# Altium schematic sheet VTI_CO2_v2.0.SchDoc: {Наимен. в 1 строку}
size 420 x 297 mm; ApprovedBy: {Утвердил}; CheckedBy: {Проверил}; DrawnBy: {Разработал}; Engineer: {Доп. поле}; Title1str: {Наимен. 1 из 2 строк}; PageSetup: Record=PageOptions|CenterHorizontal=False|CenterVertical=False|PrintScale=0.95|XCorrection=0.00|YCorrection=0.00|PrintKind=2|BorderSize=5000000|LeftOffset=0|BottomOffset=0|Orientation=2|PaperLength=1000|PaperWidth=1000|Scale=100|PaperSource=15|PrintQuality=600|MediaType=1|DitherType=10|PrintScaleMode=1|PaperKind=A4|PaperIndex=9; Title2str: {Наимен. 2 из 2 строк}; ProcessInspection: {Т.контр.}; NormInspection: {Н.контр.}; EngineerName: {Инженер}; DocumentType2str: Схема электрическая принципиальная; ChangeSheet: {1}; NoticeNumber: ИИ, АЦДР.хххх; Rule: PcbType=ProtelPcb
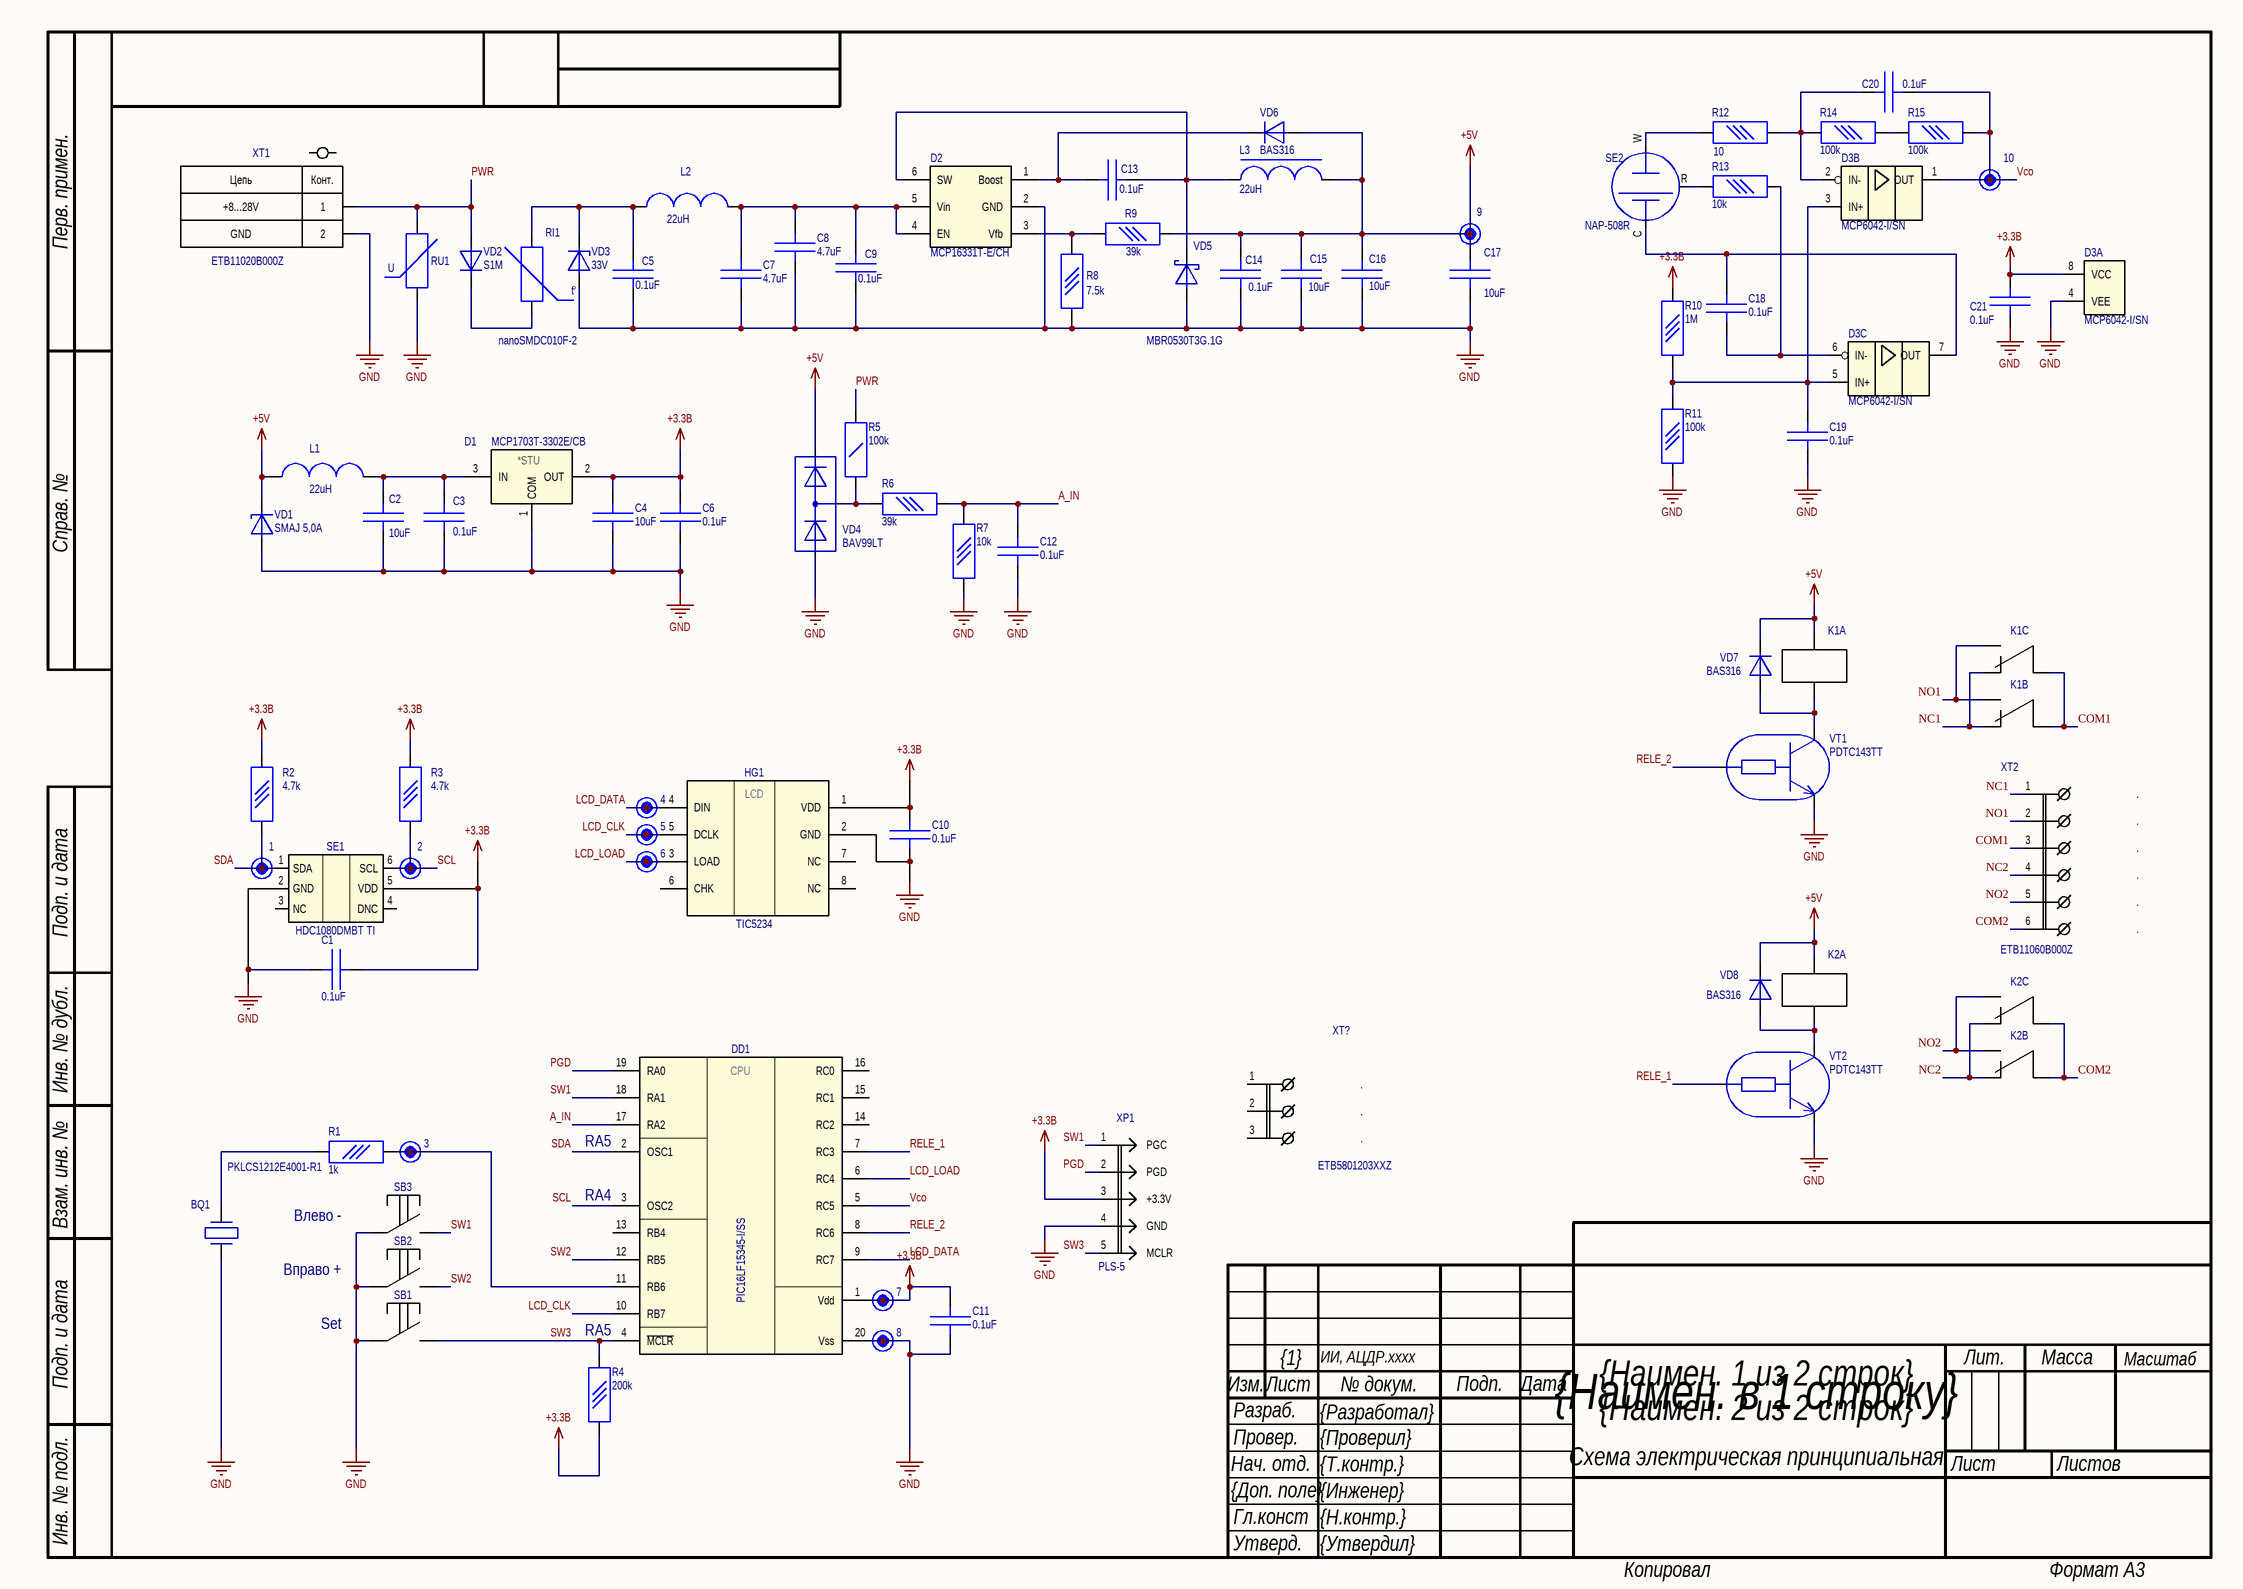
[diagram p0: VTI_CO2_v2.0.SchDoc]

## Parts
1  (no value)  [TP_80_PAD]  (no BOM)
2  (no value)  [TP_80_PAD]  (no BOM)
3  (no value)  [TP_80_PAD]  (no BOM)
4  (no value)  [TP_80_PAD]  (no BOM)
5  (no value)  [TP_80_PAD]  (no BOM)
6  (no value)  [TP_80_PAD]  (no BOM)
7  (no value)  [TP_80_PAD]  (no BOM)
8  (no value)  [TP_80_PAD]  (no BOM)
9  (no value)  [TP_80_PAD]  (no BOM)
10  (no value)  [TP_80_PAD]  (no BOM)
BQ1  PKLCS1212E4001-R1  [PKLCS1212E4001]
C1  0.1uF  [CC0603_0.8mm]
C2  10uF  [CC0805_1.25mm]
C3  0.1uF  [CC0603_0.8mm]
C4  10uF  [CC0805_1.25mm]
C5  0.1uF  [CC0805_0.85mm]
C6  0.1uF  [CC0603_0.8mm]
C7  4.7uF  [CC1210_2.5mm]
C8  4.7uF  [CC1210_2.5mm]
C9  0.1uF  [CC0805_0.85mm]
C10  0.1uF  [CC0603_0.8mm]
C11  0.1uF  [CC0603_0.8mm]
C12  0.1uF  [CC0603_0.8mm]
C13  0.1uF  [CC0603_0.8mm]
C14  0.1uF  [CC0603_0.8mm]
C15  10uF  [CC0805_1.25mm]
C16  10uF  [CC0805_1.25mm]
C17  10uF  [CC0805_1.25mm]
C18  0.1uF  [CC0603_0.8mm]
C19  0.1uF  [CC0603_0.8mm]
C20  0.1uF  [CC0603_0.8mm]
C21  0.1uF  [CC0603_0.8mm]
D1  MCP1703T-3302E/CB  [SOT-23A_MCP]
D2  MCP16331T-E/CH  [SOT-23-6]
D3  MCP6042-I/SN  [SO-8_TI]  (parts A,B,C of 3)
DD1  PIC16LF15345-I/SS  [SSOP-20_TI]
HG1  TIC5234  [TIC5234_1]
K1  G5V-2-H1 5DC BY OMZ  [G5V-2]  (value not drawn)  (parts A,B,C of 3)
K2  G5V-2-H1 5DC BY OMZ  [G5V-2]  (value not drawn)  (parts A,B,C of 3)
L1  22uH  [LQH43C]
L2  22uH  [LQH43C]
L3  22uH  [SRR3818A]
R1  1k  [RC0603]
R2  4.7k  [RC0603]
R3  4.7k  [RC0603]
R4  200k  [RC0603]
R5  100k  [RC1206]
R6  39k  [RC0603]
R7  10k  [RC0603]
R8  7.5k  [RC0603]
R9  39k  [RC0603]
R10  1M  [RC0603]
R11  100k  [RC0603]
R12  10  [RC0603]
R13  10k  [RC0603]
R14  100k  [RC0603]
R15  100k  [RC0603]
RI1  nanoSMDC010F-2  [RC1206]
RU1  (no value)  [CN1206]
SB1  DTSM-62N-V-T/R  [DTSM-62N_nonstandard]  (value not drawn)
SB2  DTSM-62N-V-T/R  [DTSM-62N_nonstandard]  (value not drawn)
SB3  DTSM-62N-V-T/R  [DTSM-62N_nonstandard]  (value not drawn)
SE1  HDC1080DMBT TI  [SON-6 (DFN-6) Humidity and Temperature Sensor]
SE2  NAP-508R  [NAP-508R]
VD1  SMAJ 5,0A  [DO-214AC (SMA)]
VD2  S1M  [DO-214AC (SMA)]
VD3  33V  [DO-214AC (SMA)]
VD4  BAV99LT  [SOT-23]
VD5  MBR0530T3G.1G  [SOD-123]
VD6  BAS316  [SOD-323]
VD7  BAS316  [SOD-323]
VD8  BAS316  [SOD-323]
VT1  PDTC143TT  [SOT-23]
VT2  PDTC143TT  [SOT-23]
XP1  PLS-5  Circuit_1: PGC  Circuit_2: PGD  Circuit_3: +3.3V  Circuit_4: GND  Circuit_5: MCLR  [PLS-5]
XT1  ETB11020B000Z  Circuit_1: +8...28V  Circuit_2: GND  [ETB1102]
XT2  ETB11060B000Z  Circuit_1: .  [ETB1106]
XT?  ETB5801203XXZ  Circuit_1: .  [ETB5801203XXZ]

## Nets
+3.3B: 7.1 C1.1 C4.1 C6.2 C10.1 C11.1 C21.2 D1.2(OUT) D3.8(VCC) DD1.1(Vdd) HG1.1(VDD) R2.1(BOT) R3.1(BOT) R4.2(TOP) R10.1(BOT) SE1.5(VDD) XP1.3
+5V: 9.1 C14.1 C15.1 C16.1 C17.1 K1.A1 K2.A1 L1.1 L3.2 R9.2(TOP) VD1.1(C) VD4.2(C) VD6.2(A) VD7.1(C) VD8.1(C)
GND: 8.1 BQ1.2 C1.2 C2.2 C3.2 C4.2 C5.2 C6.1 C7.2 C8.2 C9.2 C10.2 C11.2 C12.1 C14.2 C15.2 C16.2 C17.2 C19.1 C21.1 D1.1(COM) D2.2(GND) D3.4(VEE) DD1.20(Vss) HG1.2(GND) R7.2(TOP) R8.2(TOP) R11.2(TOP) RU1.2 SB1.COM SB2.COM SB3.COM SE1.2(GND) VD1.2(A) VD3.2(A) VD4.1(A) VD5.2(A) VT1.2(E) VT2.2(E) XP1.4 XT1.2
A_IN: C12.2 DD1.17(RA2) R6.2(TOP) R7.1(BOT)
COM1: K1.COM1 K1.COM2 XT2.3
COM2: K2.COM1 K2.COM2 XT2.6
LCD_CLK: 5.1 DD1.10(RB7) HG1.5(DCLK)
LCD_DATA: 4.1 DD1.9(RC7) HG1.4(DIN)
LCD_LOAD: 6.1 DD1.6(RC4) HG1.3(LOAD)
NC1: K1.NC1 K1.NC2 XT2.1
NC2: K2.NC1 K2.NC2 XT2.4
NO1: K1.NO1 K1.NO2 XT2.2
NO2: K2.NO1 K2.NO2 XT2.5
PGD: DD1.19(RA0) XP1.2
PWR: R5.1 RU1.1 VD2.2(A) XT1.1
RELE_1: DD1.7(RC3) VT2.1(B)
RELE_2: DD1.8(RC6) VT1.1(B)
SCL: 2.1 DD1.3(OSC2) R3.2(TOP) SE1.6(SCL)
SDA: 1.1 DD1.2(OSC1) R2.2(TOP) SE1.1(SDA)
SW1: DD1.18(RA1) SB3.NO XP1.1
SW2: DD1.12(RB5) SB2.NO
SW3: DD1.4(~{MCLR}) R4.1(BOT) SB1.NO XP1.5
Vco: 10.1 C20.2 D3.1(OUT) DD1.5(RC5) R15.2(TOP)
Net3_1: 3.1 DD1.11(RB6) R1.1(BOT)
NetBQ1_1: BQ1.1 R1.2(TOP)
NetC2_1: C2.1 C3.1 D1.3(IN) L1.2
NetC5_1: C5.1 L2.1 RI1.1 VD3.1(C)
NetC7_1: C7.1 C8.1 C9.1 D2.4(EN) D2.5(Vin) L2.2
NetC13_1: C13.1 D2.1(Boost) VD6.1(C)
NetC13_2: C13.2 D2.6(SW) L3.1 VD5.1(C)
NetC18_1: C18.1 D3.6(IN-) R13.2(TOP)
NetC18_2: C18.2 D3.7(OUT) SE2.C
NetC19_2: C19.2 D3.3(IN+) D3.5(IN+) R10.2(TOP) R11.1(BOT)
NetC20_1: C20.1 D3.2(IN-) R12.2(TOP) R14.1(BOT)
NetD2_3: D2.3(Vfb) R8.1(BOT) R9.1(BOT)
NetK1_A2: K1.A2 VD7.2(A) VT1.3(C)
NetK2_A2: K2.A2 VD8.2(A) VT2.3(C)
NetR5_2: R5.2 R6.1(BOT) VD4.3(COM)
NetR12_1: R12.1(BOT) SE2.W
NetR13_1: R13.1(BOT) SE2.R
NetR14_2: R14.2(TOP) R15.1(BOT)
NetRI1_2: RI1.2 VD2.1(C)

Not connected (* = marked no-connect by the designer): DD1 13(RB4) 14(RC2) 15(RC1) 16(RC0); HG1 6(CHK) 7(NC) 8(NC); SE1 3(NC) 4(DNC); XT? 1 2 3

## Notes on the sheet
- (near DD1) RA5
- (near DD1) RA4
- Влево -
- Set
- Вправо +
- RA5
- Перв. примен.
- Справ. №
- Подп. и дата
- Инв. № дубл.
- Взам. инв. №
- Изм.
- Лист
- № докум.
- Подп.
- Дата
- Лит.
- Масса
- Масштаб
- Нач. отд.
- Провер.
- Разраб.
- Листов
- Инв. № подл.
- Гл.конст
- Утверд.
- Копировал
- Формат А3
- (in symbol CT1206K30G) U
- (in symbol ETB11020B000Z) Цепь; Конт.
- (in symbol MCP1703T-3302E/CB) *STU
- (in symbol nanoSMDC010F-2) t; °
- (in symbol PIC16LF15345-I/SS) CPU
- (in symbol TIC5234) LCD

## Library data of the parts
1-10 = TP_80_PAD: Тестпоинт монтажа; ComponentVersion: 0; Type: Testpoint; Part Number: TP_80_PAD; Name: TP_80_PAD; Creator: Турнаев С.С.; ComponentHeight: 0; PatternVersion: 0
BQ1 = PKLCS1212E4001-R1: Излучатель звуковой SMD PKLCS1212E4001-R1; Developer_ID: 340722519; DeveloperRecomend: Желательно; ComponentVersion: 0; TempRange: -40…+85; Part Number: PKLCS1212E4001-R1; Name: PKLCS1212E4001-R1; DeveloperMnemocod: PKLCS1212E4001-R1; Creator: Качанов С.В.; PatternVersion: 0; ComponentLink1Description: Manufacturer; ComponentLink2Description: Datasheet; ComponentLink2URL: \\192.168.11.60\BolidLibrary\Altium\Database\Datasheets\425462442.pdf; ComponentLink3Description: Datasheet 2; ComponentLink4Description: Datasheet 3
C1 C10 C18-C21 = C0603_X7R_0.1uF_10%_50V: Конденсатор SMD CC 0603-X7R-0,1uF (100nF)-10%-50V CL10B104KB8NNNC(D) SAMSUNG; Manufacturer: Yageo; Developer_ID: 110036202; ComponentVersion: 0; PatternVersion: 1; TempRange: -55..+125°C; Type: X7R; Voltage: 50V; Tolerance: 10%; DeveloperRecomend: Желательно; Part Number: C0603_X7R_0.1uF_10%_50V; Name: C0603_X7R_0.1uF_10%_50V; DeveloperMnemocod: C0603_X7R_0.1uF_10%_50V; Creator: Турнаев С.С.; ComponentHeight: 0.8mm; ComponentLink1Description: Manufacturer; ComponentLink1URL: http://www.yageo.com/; ComponentLink2Description: Datasheet; ComponentLink2URL: \\192.168.11.60\BolidLibrary\Altium\Database\Datasheets\170994059.pdf; ComponentLink3Description: Datasheet 2; ComponentLink4Description: Datasheet 3; Value: 0.1uF
C2 C15-C17 = C0805_X5R_10uF_10%_16V: Конденсатор SMD CC 0805-X5R-10uF-10%-16V CL21A106KOQNNNG SAMSUNG (GRM21BR61C106KE15L MURATA); Manufacturer: Yageo; Voltage: 16V; Developer_ID: 302473563; DeveloperRecomend: Желательно; ComponentVersion: 0; PatternVersion: 1; TempRange: -55..+85°C; Type: X5R; Tolerance: 10%; Value: 10uF; Name: C0805_X5R_10uF_10%_16V; Part Number: C0805_X5R_10uF_10%_16V; DeveloperMnemocod: C0805_X5R_10uF_10%_16V; Creator: Турнаев С.С.; ComponentHeight: 1.25mm; ComponentLink1Description: Manufacturer; ComponentLink1URL: http://www.yageo.com/; ComponentLink2Description: Datasheet; ComponentLink2URL: \\192.168.11.60\BolidLibrary\Altium\Database\Datasheets\727234197.pdf; ComponentLink3Description: Datasheet 2; ComponentLink4Description: Datasheet 3
C3 C13 C14 = C0603_X7R_0.1uF_10%_16V: Конденсатор SMD CC 0603-X7R-0,1uF-10%-16V CC0603KRX7R7BB104 YAGEO; Voltage: 16V; Developer_ID: 137508028; ComponentVersion: 0; PatternVersion: 1; TempRange: -55..+125°C; Type: X7R; Tolerance: 10%; Value: 0.1uF; Name: C0603_X7R_0.1uF_10%_16V; Manufacturer: Yageo; Part Number: C0603_X7R_0.1uF_10%_16V; DeveloperMnemocod: C0603_X7R_0.1uF_10%_16V; Creator: Турнаев С.С.; ComponentHeight: 0.8mm; ComponentLink1Description: Manufacturer; ComponentLink1URL: http://www.yageo.com/; ComponentLink2Description: Datasheet; ComponentLink2URL: \\192.168.11.60\BolidLibrary\Altium\Database\Datasheets\170994059.pdf; ComponentLink3Description: Datasheet 2; ComponentLink4Description: Datasheet 3
C4 = C0805_X5R_10uF_10%_16V: Конденсатор SMD CC 0805-X5R-10uF-10%-16V CL21A106KOQNNNG SAMSUNG (GRM21BR61C106KE15L MURATA); Manufacturer: Yageo; ComponentVersion: 0; PatternVersion: 1; TempRange: -55..+85°C; Type: X5R; Voltage: 16V; Tolerance: 10%; Developer_ID: 302473563; DeveloperRecomend: Желательно; Part Number: C0805_X5R_10uF_10%_16V; Name: C0805_X5R_10uF_10%_16V; Creator: Турнаев С.С.; ComponentHeight: 1.25mm; ComponentLink1Description: Manufacturer; ComponentLink1URL: http://www.yageo.com/; ComponentLink2Description: Datasheet; ComponentLink3Description: Datasheet 2; ComponentLink4Description: Datasheet 3; Value: 10uF; DeveloperMnemocod: C0805_X5R_10uF_10%_16V; ComponentLink2URL: \\192.168.11.60\BolidLibrary\Altium\Database\Datasheets\727234197.pdf
C5 C9 = C0805_X7R_0.1uF_10%_50V: Конденсатор SMD CC 0805-X7R-0,1uF (100nF)-10%-50V 2238 580 15649 (CC0805KRX7R9BB104) YAGEO; Voltage: 50V; Developer_ID: 94754825; DeveloperRecomend: Желательно; ComponentVersion: 0; PatternVersion: 1; TempRange: -55..+125°C; Type: X7R; Tolerance: 10%; Value: 0.1uF; Manufacturer: Yageo; Name: C0805_X7R_0.1uF_10%_50V; Part Number: C0805_X7R_0.1uF_10%_50V; DeveloperMnemocod: C0805_X7R_0.1uF_10%_50V; Creator: Турнаев С.С.; ComponentHeight: 0.85mm; ComponentLink1Description: Manufacturer; ComponentLink1URL: http://www.yageo.com/; ComponentLink2Description: Datasheet; ComponentLink2URL: \\192.168.11.60\BolidLibrary\Altium\Database\Datasheets\170994059.pdf; ComponentLink3Description: Datasheet 2; ComponentLink3URL: \\192.168.11.60\BolidLibrary\Altium\Database\Datasheets\239067422.pdf; ComponentLink4Description: Datasheet 3
C6 C12 = C0603_X7R_0.1uF_10%_50V: Конденсатор SMD CC 0603-X7R-0,1uF (100nF)-10%-50V CL10B104KB8NNNC(D) SAMSUNG; Manufacturer: Yageo; ComponentVersion: 0; PatternVersion: 1; TempRange: -55..+125°C; Type: X7R; Voltage: 50V; Tolerance: 10%; Developer_ID: 110036202; DeveloperRecomend: Желательно; Part Number: C0603_X7R_0.1uF_10%_50V; Name: C0603_X7R_0.1uF_10%_50V; Creator: Турнаев С.С.; ComponentHeight: 0.8mm; ComponentLink1Description: Manufacturer; ComponentLink1URL: http://www.yageo.com/; ComponentLink2Description: Datasheet; ComponentLink3Description: Datasheet 2; ComponentLink4Description: Datasheet 3; Value: 0.1uF; DeveloperMnemocod: C0603_X7R_0.1uF_10%_50V; ComponentLink2URL: \\192.168.11.60\BolidLibrary\Altium\Database\Datasheets\170994059.pdf
C7 C8 = C1210_X7R_4.7uF_10%_50V: Конденсатор SMD CC 1210-X7R-4,7uF-10%-50V CL32B475KBUYNNE SAMSUNG (CL32B475KBJN3WE SAMSUNG); Manufacturer: Yageo; AnalogSCH: C1210_X7R_4.7uF_10%_50V_1; Developer_ID: 296538215; DeveloperRecomend: Желательно; ComponentVersion: 0; TempRange: -55..+125°C; Type: X7R; Voltage: 50V; Tolerance: 10%; Part Number: C1210_X7R_4.7uF_10%_50V; Name: C1210_X7R_4.7uF_10%_50V; DeveloperMnemocod: C1210_X7R_4.7uF_10%_50V; Creator: Турнаев С.С.; ComponentHeight: 2.5mm; PatternVersion: 0; ComponentLink1Description: Manufacturer; ComponentLink1URL: http://www.yageo.com/; ComponentLink2Description: Datasheet; ComponentLink2URL: \\192.168.11.60\BolidLibrary\Altium\Database\Datasheets\395068872.pdf; ComponentLink3Description: Datasheet 2; ComponentLink3URL: \\192.168.11.60\BolidLibrary\Altium\Database\Datasheets\817977306.pdf; ComponentLink4Description: Datasheet 3; Value: 4.7uF
C11 = C0603_X7R_0.1uF_10%_50V: Конденсатор SMD CC 0603-X7R-0,1uF (100nF)-10%-50V CL10B104KB8NNNC(D) SAMSUNG; Manufacturer: Yageo; AnalogSCH: C0603_X7R_0.1uF_10%_50V_1;C0603_X7R_0.1uF_10%_50V_2; Developer_ID: 110036202; ComponentVersion: 0; PatternVersion: 1; TempRange: -55..+125°C; Type: X7R; Voltage: 50V; Tolerance: 10%; DeveloperRecomend: Желательно; AnalogID: 1073716623:1;1086184363:1; Part Number: C0603_X7R_0.1uF_10%_50V; Name: C0603_X7R_0.1uF_10%_50V; DeveloperMnemocod: C0603_X7R_0.1uF_10%_50V; Creator: Турнаев С.С.; ComponentHeight: 0.8mm; ComponentLink1Description: Manufacturer; ComponentLink1URL: http://www.yageo.com/; ComponentLink2Description: Datasheet; ComponentLink2URL: \\192.168.11.60\BolidLibrary\Altium\Database\Datasheets\170994059.pdf; ComponentLink3Description: Datasheet 2; ComponentLink4Description: Datasheet 3; Value: 0.1uF
D1 = MCP1703T-3302E/CB: Микросхема SMD MCP1703T-3302E/CB; Manufacturer: Microchip; Developer_ID: 160150968; DeveloperRecomend: Желательно; ComponentVersion: 0; Value: 3.3V; Type: LDO; Part Number: MCP1703T-3302E/CB; Name: MCP1703T-3302E/CB; DeveloperMnemocod: MCP1703T-3302E/CB; Creator: Кравченко И.С.; PatternVersion: 0; ComponentLink1Description: Manufacturer; ComponentLink1URL: http://www.microchip.com/; ComponentLink2Description: Datasheet; ComponentLink2URL: \\192.168.11.60\BolidLibrary\Altium\Database\Datasheets\160780762.pdf; ComponentLink3Description: Datasheet 2; ComponentLink3URL: \\192.168.11.60\BolidLibrary\Altium\Database\Datasheets\238570007.pdf; ComponentLink4Description: Datasheet 3
D2 = MCP16331T-E/CH: Микросхема SMD MCP16331T-E/CH; Developer_ID: 711373292; DeveloperRecomend: Желательно; ComponentVersion: 0; PatternVersion: 1; TempRange: -40…+125; Part Number: MCP16331T-E/CH; Name: MCP16331T-E/CH; DeveloperMnemocod: MCP16331T-E/CH; Creator: Качанов С.В.; ComponentHeight: 1.45mm; ComponentLink1Description: Manufacturer; ComponentLink2Description: Datasheet; ComponentLink2URL: \\192.168.11.60\BolidLibrary\Altium\Database\Datasheets\711554596.pdf; ComponentLink3Description: Datasheet 2; ComponentLink4Description: Datasheet 3
D3 = MCP6042-I/SN: Микросхема SMD MCP6042-I/SN; Manufacturer: Microchip; Developer_ID: 135300367; ComponentVersion: 0; Type: Rail-to-Rail; Amps per case: 2; Part Number: MCP6042-I/SN; Name: MCP6042-I/SN; DeveloperMnemocod: MCP6042-I/SN; Creator: Турнаев С.С.; PatternVersion: 0; ComponentLink1Description: Manufacturer; ComponentLink1URL: https://www.microchip.com; ComponentLink2Description: Datasheet; ComponentLink2URL: \\192.168.11.60\BolidLibrary\Altium\Database\Datasheets\844798573.pdf; ComponentLink3Description: Datasheet 2; ComponentLink4Description: Datasheet 3
DD1 = PIC16LF15345-I/SS: Микросхема SMD PIC16LF15345-I/SS; Manufacturer: Microchip; Developer_ID: 1349035161; ComponentVersion: 0; TempRange: -40…+85°C; Part Number: PIC16LF15345-I/SS; Name: PIC16LF15345-I/SS; DeveloperMnemocod: PIC16LF15345-I/SS; Creator: Качанов; ComponentHeight: 2mm; PatternVersion: 0; ComponentLink1Description: Manufacturer; ComponentLink2Description: Datasheet; ComponentLink2URL: \\192.168.11.60\BolidLibrary\Altium\Database\Datasheets\1349419838.pdf; ComponentLink3Description: Datasheet 2; ComponentLink4Description: Datasheet 3; Type: 8Bit
HG1 = TIC5234: ЖК дисплей TIC5234; Developer_ID: 767047942; ComponentVersion: 0; Part Number: TIC5234; Name: TIC5234; DeveloperMnemocod: TIC5234; Creator: Гайсумов Р.А.; PatternVersion: 0; Pattern2Version: 0; ComponentLink1Description: Manufacturer; ComponentLink2Description: Datasheet; ComponentLink3Description: Datasheet 2; ComponentLink4Description: Datasheet 3
K1 K2 = G5V-2-H1 5DC BY OMZ: Реле G5V-2-H1 5DC BY OMZ; Manufacturer: OMRON; Developer_ID: 171559906; DeveloperRecomend: Желательно; ComponentVersion: 0; PatternVersion: 1; Value: 5VDC; Part Number: G5V-2-H1 5DC BY OMZ; Name: G5V-2-H1 5DC BY OMZ; DeveloperMnemocod: G5V-2-H1 5DC BY OMZ; Creator: Кравченко И.С.; ComponentHeight: 11.4; ComponentLink1Description: Manufacturer; ComponentLink1URL: http://components.omron.eu/Products/Relays; ComponentLink2Description: Datasheet; ComponentLink2URL: \\192.168.11.60\BolidLibrary\Altium\Database\Datasheets\171599433.pdf; ComponentLink3Description: Datasheet 2; ComponentLink4Description: Datasheet 3; Type: DPDT
L1 L2 = LQH43C-22uH: Индуктивность SMD 1812 LQH43C-22uH; Developer_ID: 110700287; DeveloperRecomend: Не желат.; ComponentVersion: 0; Value: 22uH; Part Number: LQH43C-22uH; Name: LQH43C-22uH; DeveloperMnemocod: LQH43C-22uH; Creator: Качанов С.В.; PatternVersion: 0; ComponentLink1Description: Manufacturer; ComponentLink2Description: Datasheet; ComponentLink2URL: \\192.168.11.60\BolidLibrary\Altium\Database\Datasheets\365582300.pdf; ComponentLink3Description: Datasheet 2; ComponentLink4Description: Datasheet 3; ComponentHeight: 2.8mm
L3 = SRR3818A-220M: Индуктивность SMD SRR3818A-220M, 22мкГн (3,8х3,8х1,8); Developer_ID: 1376392516; ComponentVersion: 0; TempRange: -40…+150; Value: 22uH; Part Number: SRR3818A-220M; Name: SRR3818A-220M; DeveloperMnemocod: SRR3818A-220M; Creator: Куницкий А.В.; ComponentHeight: 1.8mm; PatternVersion: 0; ComponentLink1Description: Manufacturer; ComponentLink2Description: Datasheet; ComponentLink3Description: Datasheet 2; ComponentLink4Description: Datasheet 3
R1 = 0603-1K-5%: Резистор SMD CR 0603-1K-5%-1/10W; Manufacturer: Yageo; AnalogDB: 0603-1K-1%; Developer_ID: 127412807; DeveloperRecomend: Желательно; ComponentVersion: 0; PatternVersion: 1; TempRange: -55..+155°C; Tolerance: ±5%; TemperatureCoef: ±100 ppm/°C; MaxWorkingVoltage: 50V; PowerDiss: 0.1 W; Part Number: 0603-1K-5%; Name: 0603-1K-5%; DeveloperMnemocod: 0603-1K-5%; Creator: Турнаев С.С.; ComponentHeight: 0.45mm; ComponentLink1Description: Manufacturer; ComponentLink1URL: http://www.yageo.com/; ComponentLink2Description: Datasheet; ComponentLink2URL: \\192.168.11.60\BolidLibrary\Altium\Database\Datasheets\465403990.pdf; ComponentLink3Description: Datasheet 2; ComponentLink4Description: Datasheet 3; Value: 1k; Type: General purpose
R2 R3 = 0603-4K7-5%: Резистор SMD CR 0603-4K7-5%-1/10W; Manufacturer: Yageo; Developer_ID: 120308499; DeveloperRecomend: Желательно; AnalogDB: 0603-4K7-1%; ComponentVersion: 0; PatternVersion: 1; TempRange: -55..+155°C; Tolerance: ±5%; TemperatureCoef: ±100 ppm/°C; MaxWorkingVoltage: 50V; PowerDiss: 0.1 W; Part Number: 0603-4K7-5%; Name: 0603-4K7-5%; DeveloperMnemocod: 0603-4K7-5%; Creator: Турнаев С.С.; ComponentHeight: 0.45mm; ComponentLink1Description: Manufacturer; ComponentLink1URL: http://www.yageo.com/; ComponentLink2Description: Datasheet; ComponentLink2URL: \\192.168.11.60\BolidLibrary\Altium\Database\Datasheets\465403990.pdf; ComponentLink3Description: Datasheet 2; ComponentLink3URL: \\192.168.11.60\BolidLibrary\Altium\Database\Datasheets\1436324605.pdf; ComponentLink4Description: Datasheet 3; Value: 4.7k; Type: General purpose
R4 = 0603-200K-5%: Резистор SMD CR 0603-200K-5%-1/10W; Manufacturer: Yageo; Developer_ID: 94718352; DeveloperRecomend: Желательно; AnalogDB: 0603-200K-1%; ComponentVersion: 0; PatternVersion: 1; TempRange: -55..+155°C; Tolerance: ±5%; TemperatureCoef: ±100 ppm/°C; MaxWorkingVoltage: 50V; PowerDiss: 0.1 W; Part Number: 0603-200K-5%; Name: 0603-200K-5%; DeveloperMnemocod: 0603-200K-5%; Creator: Турнаев С.С.; ComponentHeight: 0.45mm; ComponentLink1Description: Manufacturer; ComponentLink1URL: http://www.yageo.com/; ComponentLink2Description: Datasheet; ComponentLink2URL: \\192.168.11.60\BolidLibrary\Altium\Database\Datasheets\465403990.pdf; ComponentLink3Description: Datasheet 2; ComponentLink3URL: \\192.168.11.60\BolidLibrary\Altium\Database\Datasheets\1436324605.pdf; ComponentLink4Description: Datasheet 3; Value: 200k; Type: General purpose
R5 = 1206-100K-5%: Резистор SMD CR 1206-100K-5%-1/4W; Manufacturer: Yageo; Developer_ID: 107405237; DeveloperRecomend: Желательно; AnalogDB: 1206-100K-1%; ComponentVersion: 0; PatternVersion: 1; TempRange: -55..+155°C; Tolerance: ±5%; TemperatureCoef: ±100 ppm/°C; MaxWorkingVoltage: 200V; PowerDiss: 0.25 W; Part Number: 1206-100K-5%; Name: 1206-100K-5%; DeveloperMnemocod: 1206-100K-5%; Creator: Турнаев С.С.; ComponentHeight: 0.55mm; Pattern2Version: 0; ComponentLink1Description: Manufacturer; ComponentLink1URL: http://www.yageo.com/; ComponentLink2Description: Datasheet; ComponentLink2URL: \\192.168.11.60\BolidLibrary\Altium\Database\Datasheets\239072439.pdf; ComponentLink3Description: Datasheet 2; ComponentLink4Description: Datasheet 3; Value: 100k
R6 R9 = 0603-39K-1%: Резистор SMD CR 0603-39K-1%-1/10W; Manufacturer: Yageo; Tolerance: ±1%; Developer_ID: 596709410; DeveloperRecomend: Желательно; ComponentVersion: 0; PatternVersion: 1; TempRange: -55..+155°C; TemperatureCoef: ±100 ppm/°C; MaxWorkingVoltage: 50V; PowerDiss: 0.1 W; Value: 39k; Part Number: 0603-39K-1%; Name: 0603-39K-1%; DeveloperMnemocod: 0603-39K-1%; Creator: Турнаев С.С.; ComponentHeight: 0.45mm; ComponentLink1Description: Manufacturer; ComponentLink1URL: http://www.yageo.com/; ComponentLink2Description: Datasheet; ComponentLink2URL: \\192.168.11.60\BolidLibrary\Altium\Database\Datasheets\465403990.pdf; ComponentLink3Description: Datasheet 2; ComponentLink4Description: Datasheet 3
  R6: ComponentLink3URL: \\192.168.11.60\BolidLibrary\Altium\Database\Datasheets\1436324605.pdf
R7 = 0603-10K-1%: Резистор SMD CR 0603-10K-1%-1/10W; Manufacturer: Yageo; Tolerance: ±1%; Developer_ID: 110403509; DeveloperRecomend: Желательно; ComponentVersion: 0; PatternVersion: 1; TempRange: -55..+155°C; TemperatureCoef: ±100 ppm/°C; MaxWorkingVoltage: 50V; PowerDiss: 0.1 W; Value: 10k; Part Number: 0603-10K-1%; Name: 0603-10K-1%; DeveloperMnemocod: 0603-10K-1%; Creator: Турнаев С.С.; ComponentHeight: 0.45mm; ComponentLink1Description: Manufacturer; ComponentLink1URL: http://www.yageo.com/; ComponentLink2Description: Datasheet; ComponentLink2URL: \\192.168.11.60\BolidLibrary\Altium\Database\Datasheets\465403990.pdf; ComponentLink3Description: Datasheet 2; ComponentLink4Description: Datasheet 3; ComponentLink3URL: \\192.168.11.60\BolidLibrary\Altium\Database\Datasheets\1436324605.pdf
R8 = 0603-7K5-1%: Резистор SMD CR 0603-7K5-1%-1/10W; Manufacturer: Yageo; Tolerance: ±1%; Developer_ID: 135785877; DeveloperRecomend: Желательно; ComponentVersion: 0; PatternVersion: 1; TempRange: -55..+155°C; TemperatureCoef: ±100 ppm/°C; MaxWorkingVoltage: 50V; PowerDiss: 0.1 W; Value: 7.5k; Part Number: 0603-7K5-1%; Name: 0603-7K5-1%; DeveloperMnemocod: 0603-7K5-1%; Creator: Турнаев С.С.; ComponentHeight: 0.45mm; ComponentLink1Description: Manufacturer; ComponentLink1URL: http://www.yageo.com/; ComponentLink2Description: Datasheet; ComponentLink2URL: \\192.168.11.60\BolidLibrary\Altium\Database\Datasheets\465403990.pdf; ComponentLink3Description: Datasheet 2; ComponentLink4Description: Datasheet 3
R10 = 0603-1M-1%: Резистор SMD CR 0603-1M-1%-1/10W; Manufacturer: Yageo; Developer_ID: 591634663; ComponentVersion: 0; PatternVersion: 1; TempRange: -55..+155°C; Tolerance: ±1%; TemperatureCoef: ±100 ppm/°C; MaxWorkingVoltage: 50V; PowerDiss: 0.1 W; Part Number: 0603-1M-1%; Name: 0603-1M-1%; DeveloperMnemocod: 0603-1M-1%; Creator: Турнаев С.С.; ComponentHeight: 0.45mm; ComponentLink1Description: Manufacturer; ComponentLink1URL: http://www.yageo.com/; ComponentLink2Description: Datasheet; ComponentLink2URL: \\192.168.11.60\BolidLibrary\Altium\Database\Datasheets\465403990.pdf; ComponentLink3Description: Datasheet 2; ComponentLink4Description: Datasheet 3; Value: 1M
R11 = 0603-100K-1%: Резистор SMD CR 0603-100K-1%-1/10W; Manufacturer: Yageo; Developer_ID: 110403916; ComponentVersion: 0; PatternVersion: 1; TempRange: -55..+155°C; Tolerance: ±1%; TemperatureCoef: ±100 ppm/°C; MaxWorkingVoltage: 50V; PowerDiss: 0.1 W; Part Number: 0603-100K-1%; Name: 0603-100K-1%; DeveloperMnemocod: 0603-100K-1%; Creator: Турнаев С.С.; ComponentHeight: 0.45mm; ComponentLink1Description: Manufacturer; ComponentLink1URL: http://www.yageo.com/; ComponentLink2Description: Datasheet; ComponentLink2URL: \\192.168.11.60\BolidLibrary\Altium\Database\Datasheets\465403990.pdf; ComponentLink3Description: Datasheet 2; ComponentLink4Description: Datasheet 3; Value: 100k
R12 = 0603-10R-5%: Резистор SMD CR 0603-10R-5%-1/10W; Manufacturer: Yageo; AnalogDB: 0603-10R-1%; Developer_ID: 300321944; ComponentVersion: 0; PatternVersion: 1; TempRange: -55..+155°C; Tolerance: ±5%; TemperatureCoef: ±200 ppm/°C; MaxWorkingVoltage: 50V; PowerDiss: 0.1 W; AnalogID: 605414808:1; Part Number: 0603-10R-5%; Name: 0603-10R-5%; DeveloperMnemocod: 0603-10R-5%; Creator: Турнаев С.С.; ComponentHeight: 0.45mm; ComponentLink1Description: Manufacturer; ComponentLink1URL: http://www.yageo.com/; ComponentLink2Description: Datasheet; ComponentLink2URL: \\192.168.11.60\BolidLibrary\Altium\Database\Datasheets\465403990.pdf; ComponentLink3Description: Datasheet 2; ComponentLink4Description: Datasheet 3; Value: 10; Type: General purpose
R13 = 0603-10K-1%: Резистор SMD CR 0603-10K-1%-1/10W; Manufacturer: Yageo; Developer_ID: 110403509; ComponentVersion: 0; PatternVersion: 1; TempRange: -55..+155°C; Tolerance: ±1%; TemperatureCoef: ±100 ppm/°C; MaxWorkingVoltage: 50V; PowerDiss: 0.1 W; Part Number: 0603-10K-1%; Name: 0603-10K-1%; DeveloperMnemocod: 0603-10K-1%; Creator: Турнаев С.С.; ComponentHeight: 0.45mm; ComponentLink1Description: Manufacturer; ComponentLink1URL: http://www.yageo.com/; ComponentLink2Description: Datasheet; ComponentLink2URL: \\192.168.11.60\BolidLibrary\Altium\Database\Datasheets\465403990.pdf; ComponentLink3Description: Datasheet 2; ComponentLink4Description: Datasheet 3; Value: 10k
R14 R15 = 0603-100K-1%: Резистор SMD CR 0603-100K-1%-1/10W; Manufacturer: Yageo; Developer_ID: 110403916; ComponentVersion: 0; PatternVersion: 1; TempRange: -55..+155°C; Tolerance: ±1%; TemperatureCoef: ±100 ppm/°C; MaxWorkingVoltage: 50V; PowerDiss: 0.1 W; DeveloperRecomend: Желательно; Part Number: 0603-100K-1%; Name: 0603-100K-1%; DeveloperMnemocod: 0603-100K-1%; Creator: Турнаев С.С.; ComponentHeight: 0.45mm; ComponentLink1Description: Manufacturer; ComponentLink1URL: http://www.yageo.com/; ComponentLink2Description: Datasheet; ComponentLink2URL: \\192.168.11.60\BolidLibrary\Altium\Database\Datasheets\465403990.pdf; ComponentLink3Description: Datasheet 2; ComponentLink4Description: Datasheet 3; Value: 100k; ComponentLink3URL: \\192.168.11.60\BolidLibrary\Altium\Database\Datasheets\1436324605.pdf
RI1 = nanoSMDC010F-2: Предохранитель самовосстанавливающийся nanoSMDC010F-2 (60V, 0.1A); Developer_ID: 656907661; DeveloperRecomend: Желательно; ComponentVersion: 0; PatternVersion: 1; TempRange: -40…+85; Part Number: nanoSMDC010F-2; Name: nanoSMDC010F-2; DeveloperMnemocod: nanoSMDC010F-2; Creator: Бахвалов; ComponentHeight: 0.75 mm; ComponentLink1Description: Manufacturer; ComponentLink2Description: Datasheet; ComponentLink2URL: \\192.168.11.60\BolidLibrary\Altium\Database\Datasheets\718482931.pdf; ComponentLink3Description: Datasheet 2; ComponentLink3URL: \\192.168.11.60\BolidLibrary\Altium\Database\Datasheets\737923420.pdf; ComponentLink4Description: Datasheet 3; ComponentLink4URL: \\192.168.11.60\BolidLibrary\Altium\Database\Datasheets\812944087.pdf; Value: 0.1A; Type: PTC
RU1 = CT1206K30G: Варистор SMD CT1206K30G (B72520T0300K062); AnalogSCH: TVM3B470K381HY01;MLV1206NA030V0100;82541300; Developer_ID: 220714832; DeveloperRecomend: Желательно; ComponentVersion: 0; Name: CT1206K30G; Part Number: CT1206K30G; DeveloperMnemocod: CT1206K30G; Creator: Качанов С.В.; PatternVersion: 0; ComponentLink1Description: Manufacturer; ComponentLink2Description: Datasheet; ComponentLink2URL: \\192.168.11.60\BolidLibrary\Altium\Database\Datasheets\471547735.pdf; ComponentLink3Description: Datasheet 2; ComponentLink4Description: Datasheet 3; Type: Варистор SMD
SB1-SB3 = DTSM-62N-V-T/R: Кнопка тактовая SMD DTSM-62N-V-T/R; Manufacturer: Diptronics; Note: Заказная кнопка!!! Расстояние между выводами 10мм!!!; Developer_ID: 273476920; DeveloperRecomend: Желательно; ComponentVersion: 0; Value: SMD_6.0x6.0; Part Number: DTSM-62N-V-T/R; Name: DTSM-62N-V-T/R; DeveloperMnemocod: DTSM-62N-V-T/R; Creator: Кравченко И.С.; ComponentHeight: 5; PatternVersion: 0; ComponentLink1Description: Manufacturer; ComponentLink1URL: http://www.dip.com.tw/en; ComponentLink2Description: Datasheet; ComponentLink2URL: \\192.168.11.60\BolidLibrary\Altium\Database\Datasheets\444395103.jpg; ComponentLink3Description: Datasheet 2; ComponentLink4Description: Datasheet 3; ComponentLink4URL: http://www.dip.com.tw/en/en-product-information/en-switch004/item/download/863_75cf97940e3cff15ad824b722ff03675; Type: Tact Switch
SE1 = HDC1080DMBT TI: Датчик влажности и температуры SMD HDC1080DMBT TI; ComponentVersion: 0; Developer_ID: 908955930; DeveloperRecomend: Желательно; Part Number: HDC1080DMBT TI; Name: HDC1080DMBT TI; DeveloperMnemocod: HDC1080DMBT TI; Creator: Турнаев С.С.; PatternVersion: 0; ComponentLink1Description: Manufacturer; ComponentLink2Description: Datasheet; ComponentLink2URL: \\192.168.11.60\BolidLibrary\Altium\Database\Datasheets\924646338.pdf; ComponentLink3Description: Datasheet 2; ComponentLink4Description: Datasheet 3; Type: Humidity and Temperature Sensor
SE2 = NAP-508R: Датчик угарного газа NAP-508R; Manufacturer: Nemoto; Developer_ID: 711906605; ComponentVersion: 0; TempRange: -20…+50°C; Part Number: NAP-508R; Name: NAP-508R; DeveloperMnemocod: NAP-508R; Creator: Рылов Д.В.; ComponentHeight: 8.5mm; PatternVersion: 0; ComponentLink1Description: Manufacturer; ComponentLink2Description: Datasheet; ComponentLink2URL: \\192.168.11.60\BolidLibrary\Altium\Database\Datasheets\711900577.pdf; ComponentLink3Description: Datasheet 2; ComponentLink4Description: Datasheet 3; Type: K-Band
VD1 = SMAJ 5,0A: Диод защитный SMD SMAJ 5,0A; Manufacturer: Littelfuse; Value: 5V; Developer_ID: 582698201; DeveloperRecomend: Желательно; ComponentVersion: 0; Power: 400W; Name: SMAJ 5,0A; Part Number: SMAJ 5,0A; DeveloperMnemocod: SMAJ 5,0A; Creator: Турнаев С.С.; PatternVersion: 0; ComponentLink1Description: Manufacturer; ComponentLink1URL: http://www.littelfuse.com; ComponentLink2Description: Datasheet; ComponentLink2URL: \\192.168.11.60\BolidLibrary\Altium\Database\Datasheets\165823259.pdf; ComponentLink3Description: Datasheet 2; ComponentLink3URL: \\192.168.11.60\BolidLibrary\Altium\Database\Datasheets\223609551.pdf; ComponentLink4Description: Datasheet 3; ComponentLink4URL: \\192.168.11.60\BolidLibrary\Altium\Database\Datasheets\737758410.pdf
VD2 = S1M: Диод SMD S1M (DO-214); Manufacturer: Diotec; Developer_ID: 234504280; DeveloperRecomend: Желательно; ComponentVersion: 0; Value: 1A; Vr: 1000V; Part Number: S1M; Name: S1M; DeveloperMnemocod: S1M; Creator: Турнаев С.С.; PatternVersion: 0; ComponentLink1Description: Manufacturer; ComponentLink1URL: http://diotec.com; ComponentLink2Description: Datasheet; ComponentLink2URL: \\192.168.11.60\BolidLibrary\Altium\Database\Datasheets\423106097.pdf; ComponentLink3Description: Datasheet 2; ComponentLink4Description: Datasheet 3; Type: Smd; If: 1A; ComponentLink3URL: \\192.168.11.60\BolidLibrary\Altium\Database\Datasheets\729064942.pdf
VD3 = SMAJ33A: Диод защитный SMD SMAJ33A; Manufacturer: Littelfuse; Developer_ID: 263918150; DeveloperRecomend: Желательно; ComponentVersion: 0; Power: 400W; Part Number: SMAJ33A; Name: SMAJ33A; DeveloperMnemocod: SMAJ33A; Creator: Турнаев С.С.; PatternVersion: 0; ComponentLink1Description: Manufacturer; ComponentLink1URL: http://www.littelfuse.com; ComponentLink2Description: Datasheet; ComponentLink2URL: \\192.168.11.60\BolidLibrary\Altium\Database\Datasheets\165823259.pdf; ComponentLink3Description: Datasheet 2; ComponentLink3URL: \\192.168.11.60\BolidLibrary\Altium\Database\Datasheets\737758410.pdf; ComponentLink4Description: Datasheet 3; Value: 33V
VD4 = BAV99LT: Диод SMD BAV99LT; Manufacturer: ON semi; Developer_ID: 94810034; DeveloperRecomend: Желательно; AnalogDB: BAV99, 235; ComponentVersion: 0; Value: 215mA; Vr: 100V; Part Number: BAV99LT; Name: BAV99LT; DeveloperMnemocod: BAV99LT; Creator: Турнаев С.С.; PatternVersion: 0; ComponentLink1Description: Manufacturer; ComponentLink1URL: http://www.onsemi.ru.com; ComponentLink2Description: Datasheet; ComponentLink2URL: \\192.168.11.60\BolidLibrary\Altium\Database\Datasheets\158394279.pdf; ComponentLink3Description: Datasheet 2; ComponentLink4Description: Datasheet 3; Type: Smd; If: 215mA
VD5 = MBR0530T3G.1G: Диод Шоттки SMD MBR0530T3G.1G; Manufacturer: Fairchild; Developer_ID: 590971401; DeveloperRecomend: Желательно; ComponentVersion: 0; Value: 500mA; Vr: 30V; Part Number: MBR0530T3G.1G; Name: MBR0530T3G.1G; DeveloperMnemocod: MBR0530T3G.1G; Creator: Турнаев С.С.; PatternVersion: 0; ComponentLink1Description: Manufacturer; ComponentLink1URL: http://www.fairchildsemi.com; ComponentLink2Description: Datasheet; ComponentLink2URL: \\192.168.11.60\BolidLibrary\Altium\Database\Datasheets\592176212.pdf; ComponentLink3Description: Datasheet 2; ComponentLink3URL: \\192.168.11.60\BolidLibrary\Altium\Database\Datasheets\592176653.pdf; ComponentLink4Description: Datasheet 3; ComponentLink4URL: \\192.168.11.60\BolidLibrary\Altium\Database\Datasheets\592177087.pdf; Type: Schottky; If: 500mA
VD6-VD8 = BAS316: Диод SMD BAS316,115; Manufacturer: NXP; AnalogDB: NULL,; Developer_ID: 539003371; DeveloperRecomend: Желательно; ComponentVersion: 0; Value: 250mA; Vr: 100V; Part Number: BAS316; AnalogSCH: NULL,; Name: BAS316; DeveloperMnemocod: BAS316; TestCode: NULL,; AdditionalPartDB: NULL,; AdditionalPartSCH: NULL,; SimulationModelName: NULL,; Creator: Турнаев С.С.; ComponentHeight: NULL,; PatternVersion: 0; Pattern2Version: NULL,; ComponentLink1Description: Manufacturer; ComponentLink1URL: http://www.nxp.com; ComponentLink2Description: Datasheet; ComponentLink2URL: \\192.168.11.60\BolidLibrary\Altium\Database\Datasheets\541553318.pdf; ComponentLink3Description: Datasheet 2; ComponentLink3URL: NULL,; ComponentLink4Description: Datasheet 3; ComponentLink4URL: NULL,; TempRange: NULL,; Type: Smd; If: 250mA
VT1 VT2 = PDTC143TT: Транзистор SMD PDTC143TT,215; Developer_ID: 118061637; DeveloperRecomend: Желательно; ComponentVersion: 0; Part Number: PDTC143TT; Name: PDTC143TT; DeveloperMnemocod: PDTC143TT; Creator: Качанов С.В.; PatternVersion: 0; ComponentLink1Description: Manufacturer; ComponentLink2Description: Datasheet; ComponentLink2URL: \\192.168.11.60\BolidLibrary\Altium\Database\Datasheets\170584636.pdf; ComponentLink3Description: Datasheet 2; ComponentLink4Description: Datasheet 3
XP1 = PLS-5: Соединитель штыревой PLS-5; Developer_ID: 97606656; DeveloperRecomend: Не использ; AnalogDB: PLS-1:5; ComponentVersion: 0; TempRange: 0…85°C; Pitch,mm: 2.54mm; Rows: 1; Part Number: PLS-5; Name: PLS-5; DeveloperMnemocod: PLS-5; Creator: Турнаев С.С.; PatternVersion: 0; Pattern2Version: 0; ComponentLink1Description: Manufacturer; ComponentLink2Description: Datasheet; ComponentLink2URL: \\192.168.11.60\BolidLibrary\Altium\Database\Datasheets\243802317.pdf; ComponentLink3Description: Datasheet 2; ComponentLink3URL: \\192.168.11.60\BolidLibrary\Altium\Database\Datasheets\840235437.pdf; ComponentLink4Description: Datasheet 3; Type: Plug; Pins: 5
XT1 = ETB11020B000Z: Плата соединительная ETB11020B000Z; Developer_ID: 92112599; ComponentVersion: 0; PatternVersion: 3; Part Number: ETB11020B000Z; Name: ETB11020B000Z; DeveloperMnemocod: ETB11020B000Z; Creator: Турнаев С.С.; ComponentLink1Description: Manufacturer; ComponentLink2Description: Datasheet; ComponentLink2URL: \\192.168.11.60\BolidLibrary\Altium\Database\Datasheets\210788742.pdf; ComponentLink3Description: Datasheet 2; ComponentLink4Description: Datasheet 3
XT2 = ETB11060B000Z: Плата соединительная ETB11060B000Z; Manufacturer: excel cell electronic; Developer_ID: 693116661; DeveloperRecomend: Желательно; ComponentVersion: 0; TempRange: 110°C; Circuit_2: .; Circuit_3: .; Circuit_4: .; Circuit_5: .; Circuit_6: .; Part Number: ETB11060B000Z; Name: ETB11060B000Z; DeveloperMnemocod: ETB11060B000Z; Creator: Бахвалов Д.Н.; ComponentHeight: 11mm; PatternVersion: 0; ComponentLink1Description: excel cell electronic; ComponentLink1URL: http://www.ece.com.tw/; ComponentLink2Description: Datasheet; ComponentLink2URL: \\192.168.11.60\BolidLibrary\Altium\Database\Datasheets\210788742.pdf; ComponentLink3Description: Datasheet 2; ComponentLink4Description: Datasheet 3
XT? = ETB5801203XXZ: Плата соединительная ETB5801203XXZ; Developer_ID: 1472735397; ComponentVersion: 0; Circuit_2: .; Circuit_3: .; Part Number: ETB5801203XXZ; Name: ETB5801203XXZ; DeveloperMnemocod: ETB5801203XXZ; Creator: Качанов; ComponentHeight: 13mm; PatternVersion: 0; ComponentLink1Description: Manufacturer; ComponentLink2Description: Datasheet; ComponentLink3Description: Datasheet 2